# EasyEDA schematic SCH_AC-switch-using-NANO_2026-02-16.json
TITLE: AC switch using NANO; REV: 1.0; Date: 2026-02-13; Sheet: 1/1; Company: SSGMCE
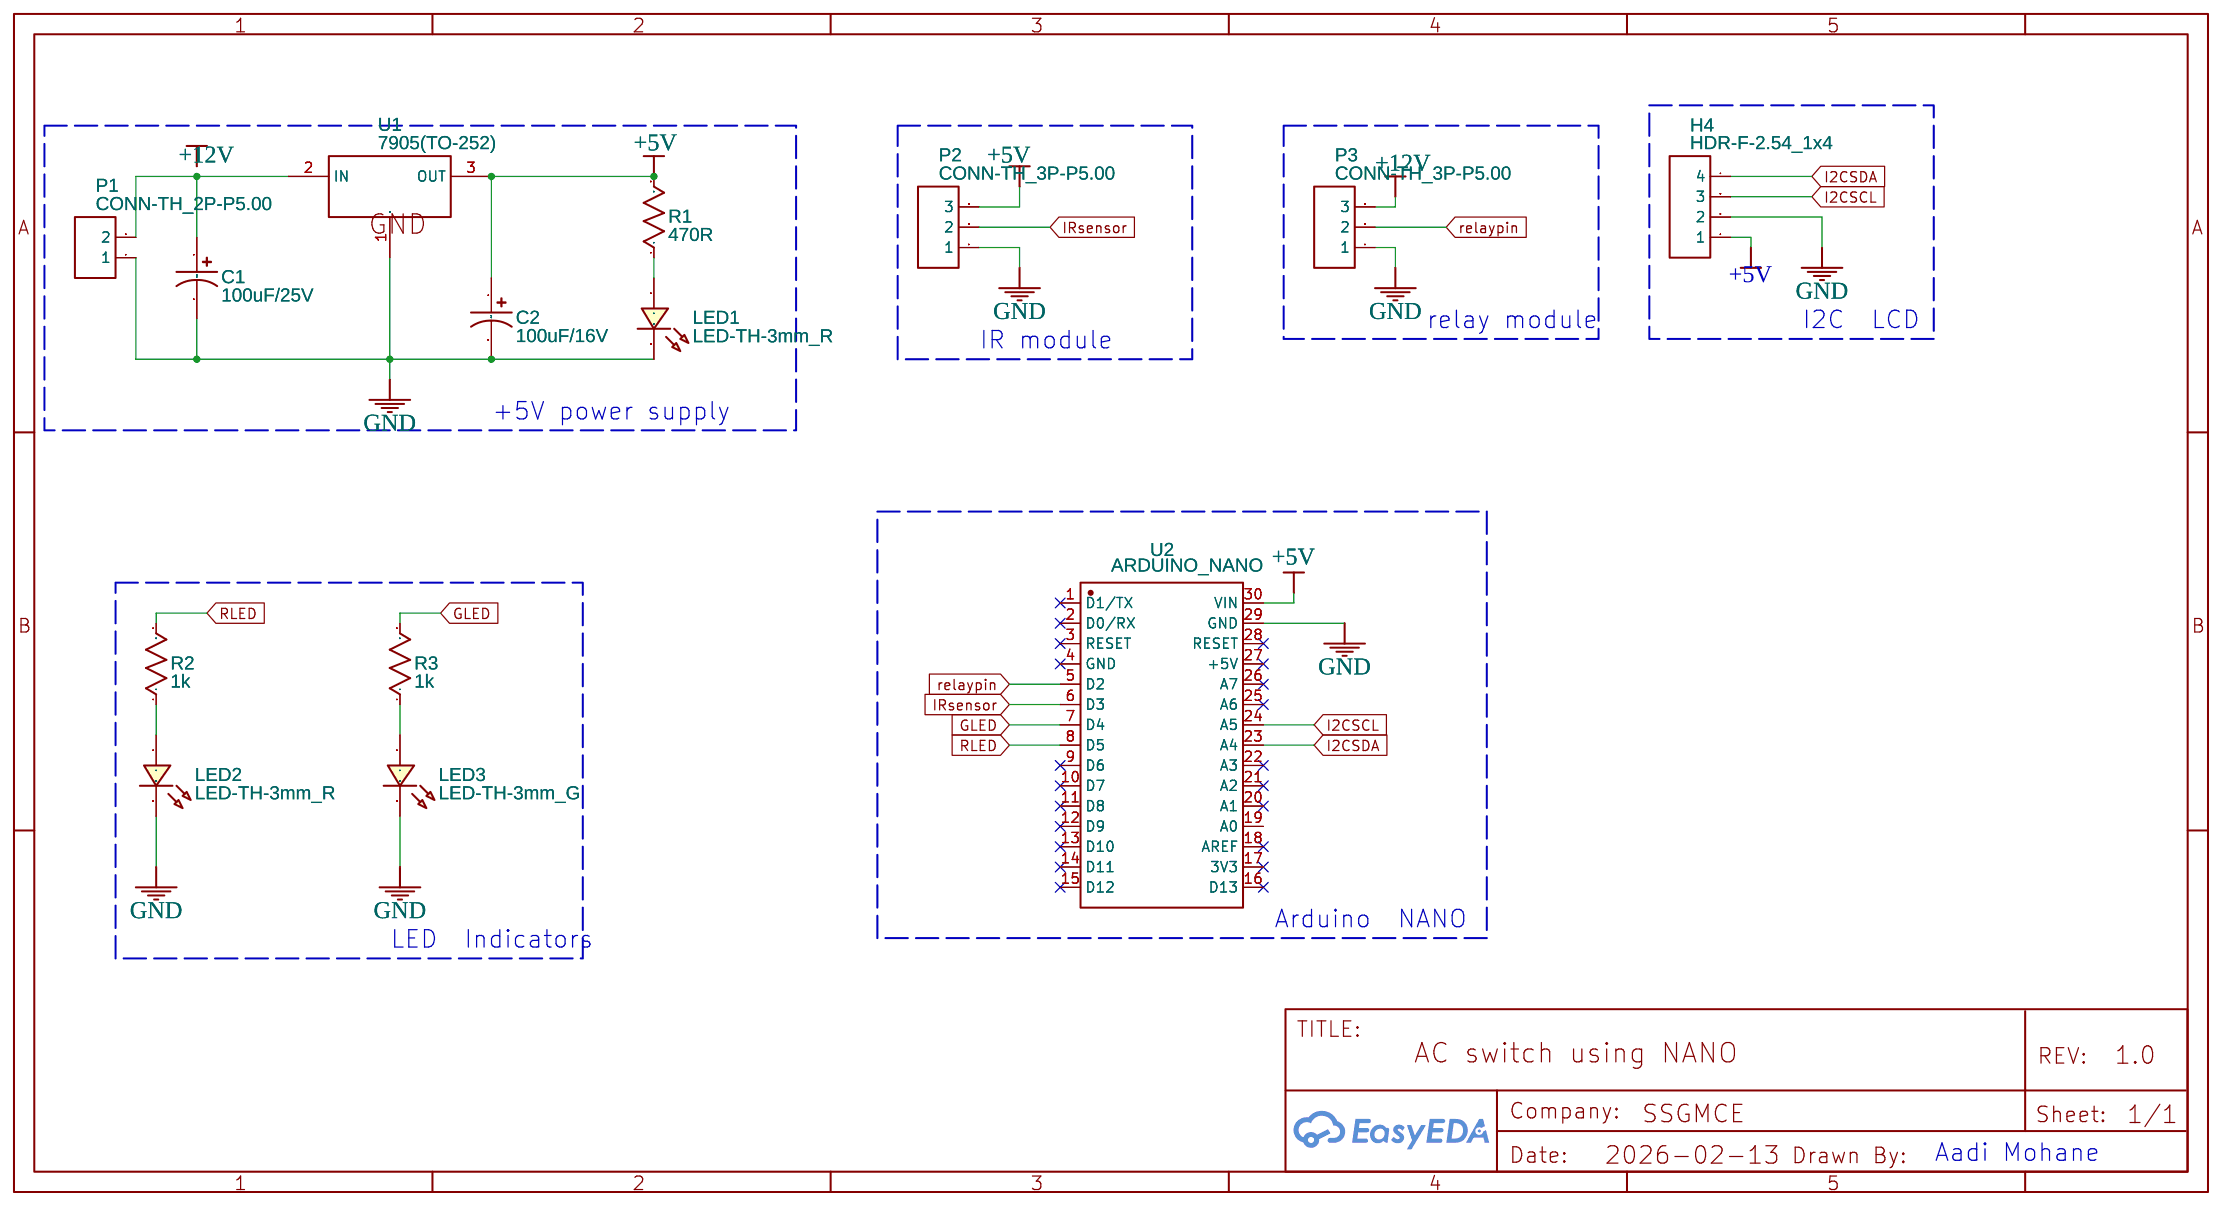
[diagram p0: schematic sheet]

## Parts
C1  100uF/25V  [CAP-D3.0×F1.5]
C2  100uF/16V  [CAP-D3.0×F1.5]
H4  HDR-F-2.54_1x4  [HDR-F-2.54_1X4]
LED1  LED-TH-3mm_R  [LED-TH_BD3.0_RED]
LED2  LED-TH-3mm_R  [LED-TH_BD3.0_RED]
LED3  LED-TH-3mm_G  [LED-TH_BD3.0_GREEN]
P1  CONN-TH_2P-P5.00  [CONN-TH_2P-P5.00]
P2  CONN-TH_3P-P5.00  [CONN-TH_3P-P5.00]
P3  CONN-TH_3P-P5.00  [CONN-TH_3P-P5.00]
R1  470R  [R_AXIAL-0.3]
R2  1k  [R_AXIAL-0.3]
R3  1k  [R_AXIAL-0.3]
U1  7905(TO-252)  [TO-252-2_L6.6-W6.1-P4.57-LS9.9-BR-CW]
U2  ARDUINO_NANO  [COMM-TH_ARDUINO_NANO]

## Library data of the parts
C1 C2 = CE_TH_D3.0×F1.5_US: Contributor: LCEDA_Lib
H4 = HDR-F-2.54_1x4: Supplier Part: C225501; Supplier: LCSC; Contributor: LCEDA_Lib
LED1 LED2 = LED-TH-3mm_R: Manufacturer: EVERLIGHT(台湾亿光); Manufacturer Part: 204-10SDRD/S530-A3-L; Supplier Part: C84774; Supplier: LCSC; Contributor: LCEDA_Lib
LED3 = LED-TH-3mm_G: Manufacturer: EVERLIGHT(台湾亿光); Manufacturer Part: 204-10SYGD/S530-E3; Supplier Part: C85161; Contributor: LCEDA_Lib
P1 = CONN-TH_2P-P5.00: Supplier: LCSC; Contributor: LCEDA_Lib
P2 P3 = CONN-TH_3P-P5.00: Supplier: LCSC; Contributor: LCEDA_Lib
R1-R3 = R_AXIAL-0.3_US: Contributor: LCEDA_Lib
U1 = 7905(TO-252): Supplier: LCSC; Manufacturer: CJ; Manufacturer Part: CJ7905; image: //image.lceda.cn/szlcsc/C78860.jpg; Supplier Part: C78860; Paste Type: expand; Contributor: LCEDA_Lib
U2 = ARDUINO_NANO: Contributor: lcsc; Supplier: LCSC; Supplier Part: C9900017879; Manufacturer: null; JLCPCB Part Class: Extended Part

## Nets
+5V: C2.1 H4.1 P2.3 R1.2 U1.3(OUT) U2.30(VIN)
+12V: P3.3
GND: C1.2 C2.2 H4.2 LED1.2 LED2.2 LED3.2 P1.1 P2.1 P3.1 U1.1(GND) U2.29(GND)
GLED: R3.2 U2.7(D4)
I2CSCL: H4.3 U2.24(A5)
I2CSDA: H4.4 U2.23(A4)
IRsensor: P2.2 U2.6(D3)
relaypin: P3.2 U2.5(D2)
RLED: R2.2 U2.8(D5)
Net-(C1-1): C1.1 P1.2 U1.2(IN)
Net-(LED1-1): LED1.1 R1.1
Net-(LED2-1): LED2.1 R2.1
Net-(LED3-1): LED3.1 R3.1

Not connected (* = marked no-connect by the designer): U2 1(D1/TX)* 2(D0/RX)* 3(RESET)* 4(GND)* 9(D6)* 10(D7)* 11(D8)* 12(D9)* 13(D10)* 14(D11)* 15(D12)* 16(D13)* 17(3V3)* 18(AREF)* 19(A0) 20(A1)* 21(A2)* 22(A3)* 25(A6)* 26(A7)* 27(+5V)* 28(RESET)*

## Notes on the sheet
- relay module
- I2C  LCD
- IR module
- +5V power supply
- Arduino  NANO
- LED  Indicators
- Aadi Mohane
- Aadi Mohane
